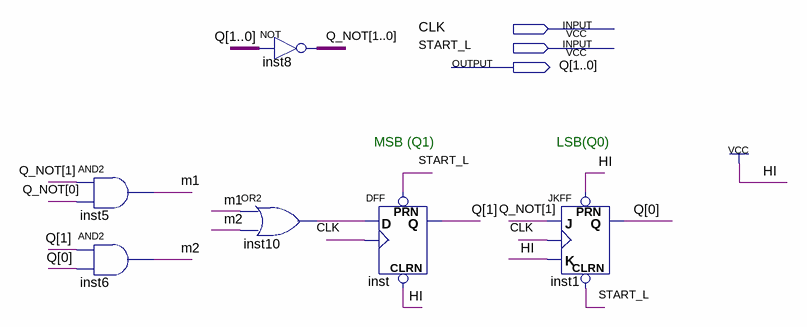
[diagram p0: schematic sheet]
// Quartus schematic quiz3.bdf as structural Verilog: 6 symbols, 3 pins
module quiz3 (
  input  CLK,
  input  START_L,
  output [1:0] Q
);

  wire inst10_out, m1, m2;
  wire [1:0] Q_NOT;

  and inst5 (m1, Q_NOT[1], Q_NOT[0]);
  and inst6 (m2, Q[1], Q[0]);
  or inst10 (inst10_out, m1, m2);
  assign Q_NOT = ~Q;  // NOT inst8, 2 bits wide
  DFF inst (.CLRN(1'b1), .CLK(CLK), .D(inst10_out), .PRN(START_L), .Q(Q[1]));
  JKFF inst1 (.PRN(1'b1), .CLRN(START_L), .K(1'b1), .J(Q_NOT[1]), .CLK(CLK), .Q(Q[0]));

  // Notes on the sheet:
  //   MSB (Q1)
  //   LSB(Q0)
endmodule
